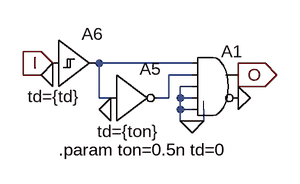
[diagram p0: schematic edge.asc]
edge.asc, the LTspice schematic file:
Version 4
SHEET 1 880 680
WIRE 80 80 -48 80
WIRE 80 96 48 96
WIRE 80 112 64 112
WIRE -48 128 -48 80
WIRE -32 128 -48 128
WIRE 48 128 48 96
WIRE 48 128 32 128
WIRE 64 128 64 112
WIRE 80 128 64 128
WIRE 64 144 64 128
WIRE 80 144 64 144
WIRE 64 160 64 144
WIRE 80 160 64 160
WIRE 96 160 96 144
WIRE 96 160 80 160
FLAG -112 80 I
IOPIN -112 80 In
FLAG 80 160 0
FLAG 144 96 O
IOPIN 144 96 Out
FLAG -32 144 0
FLAG -112 96 0
FLAG 144 128 0
SYMBOL Digital\\and 112 48 R0
SYMATTR InstName A1
SYMBOL Digital\\inv -32 64 R0
WINDOW 3 -19 110 Left 2
SYMATTR Value td={ton}
SYMATTR InstName A5
SYMBOL Digital\\schmtbuf -112 16 R0
WINDOW 3 -35 110 Left 2
SYMATTR Value td={td}
SYMATTR InstName A6
TEXT -104 200 Left 2 !.param ton=0.5n td=0

The netlist it stands for:
* edge.asc
A1 N001 N002 0 0 0 0 O 0 AND
A5 N001 0 0 0 0 N002 0 0 BUF td={ton}
A6 I 0 0 0 0 0 N001 0 SCHMITT td={td}
.param ton=0.5n td=0
.backanno
.end